# EAGLE design light (EAGLE 9.6.2)
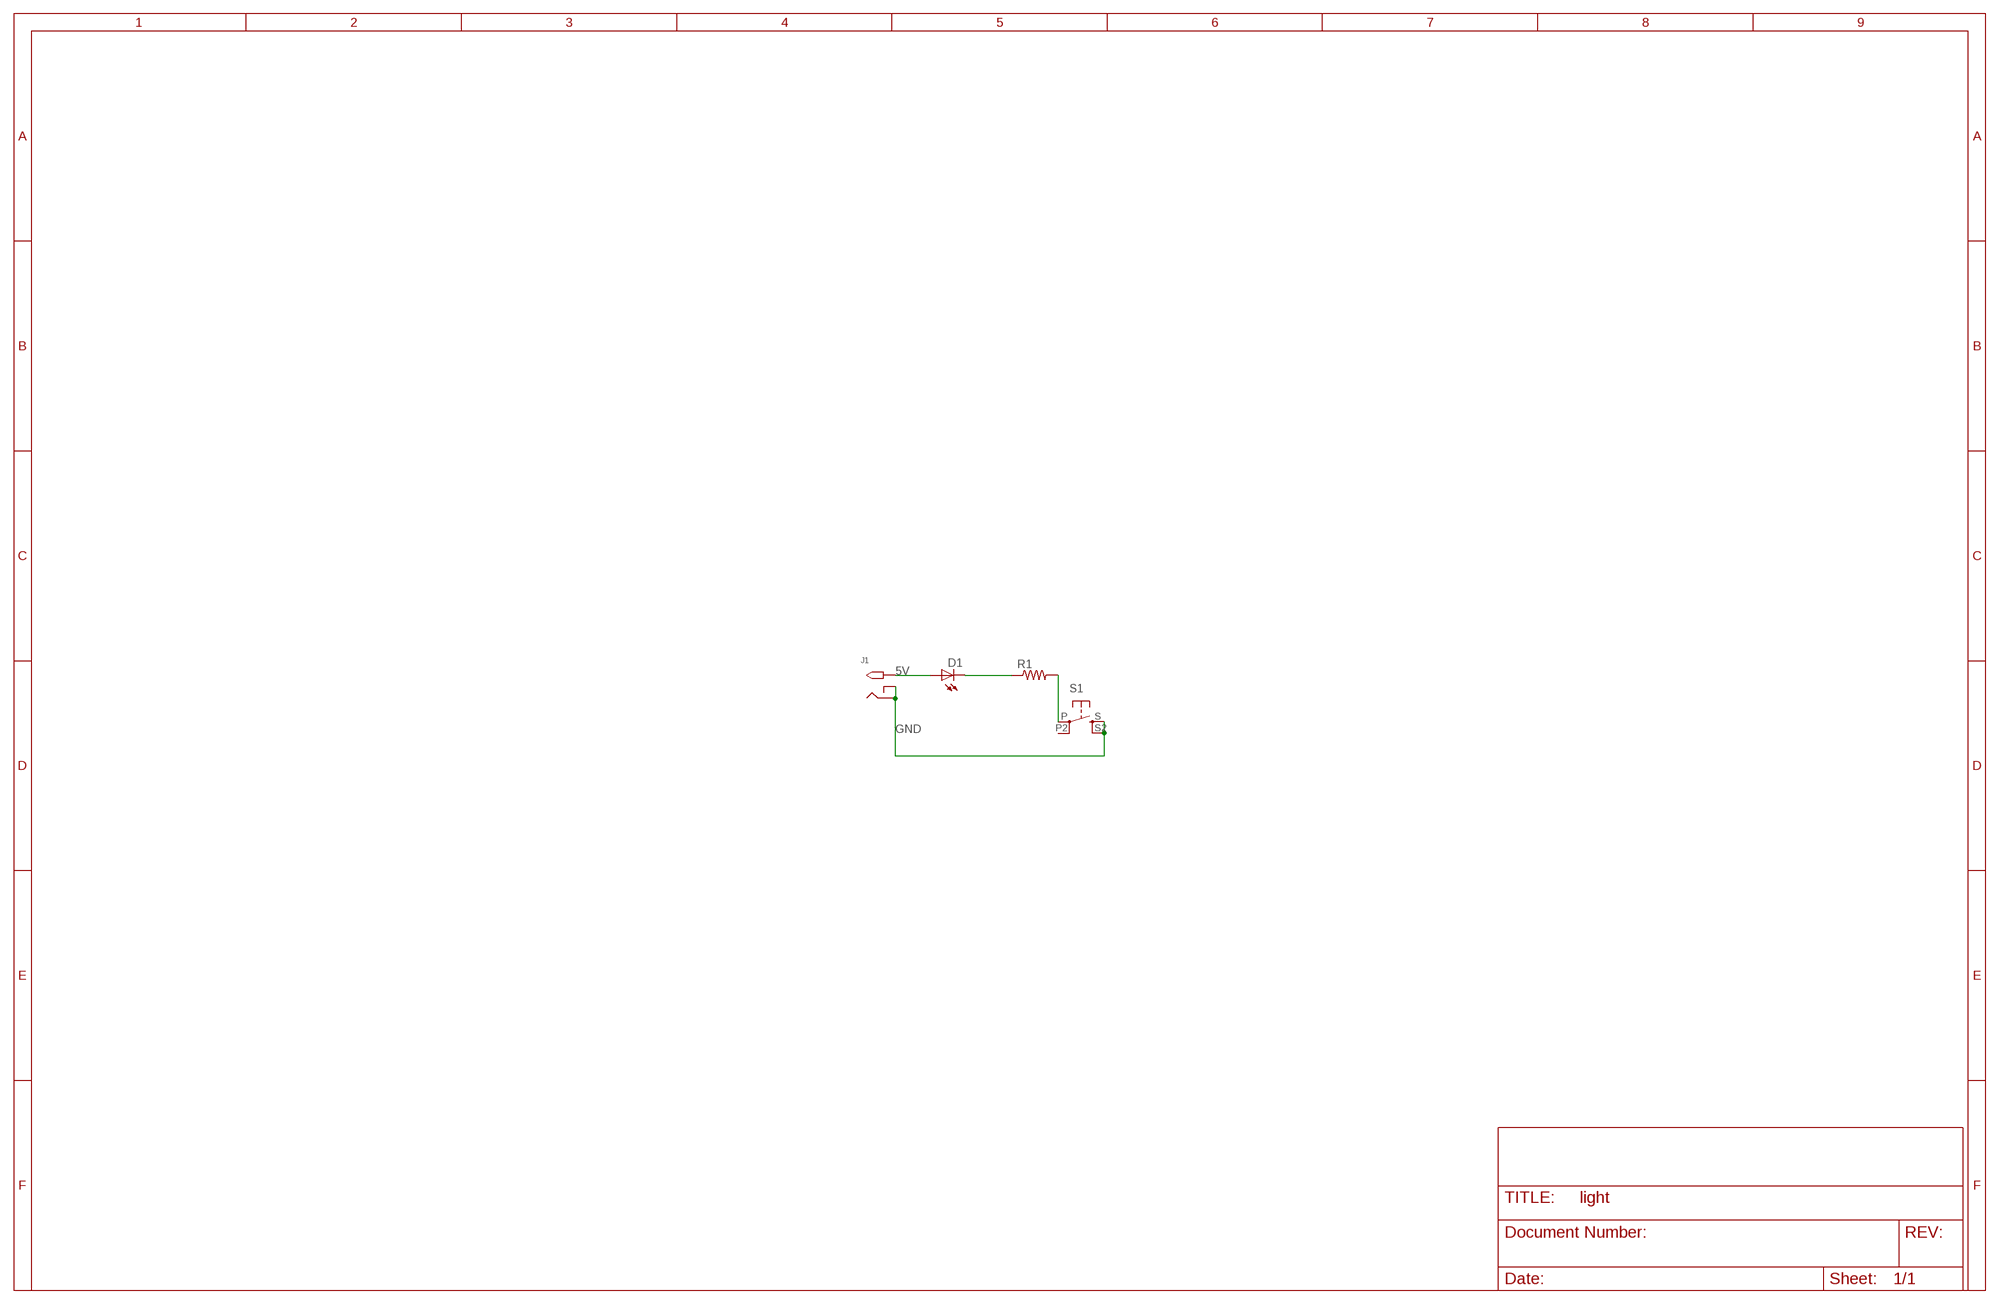
[diagram p0: schematic, sheet 1]
FRAME1 (FRAME_B_L): CREATOR: Unknown; DIST: Unknown; DISTPN: Unknown

## Parts
D1  LED5MM  [LED5MM]
J1  2.1MMJACKTHM  [PJ-102A]
R1  RESISTORTH-1/4W-CARBON  [RESAD1160W55L680D260_HS]
S1  PUSH-BUTTON-SQUARE  [BUTTON-TACTILE-SQUARE-ADAFRUIT1010]

## Nets
5V: D1.A J1.TIP
GND: J1.RING J1.RING_SW S1.S S1.S2(S1)
N$1: D1.K(C) R1.1
N$2: R1.2 S1.P
Unconnected: S1.P2(P1)

## Library data of the parts
D1 = Lab01:LED: /; CREATOR: Swanson; DIST: Adafruit; DISTPN: 297; REVIEWER: Swanson
J1 = Lab01:2.1MMJACK: 2.1mm x 5.5mm THM DC jack with internal switch. Digikey part #PJ-102A, 4UCON part #05537 2.1mm x 5.5mm SMT DC jack with internal switch. Digikey part #PJ-002A-SMT, 4UCON part #03267 By microbuilder.eu & adafruit.com; CREATOR: Swanson; DIST: Digikey; DISTPN: CP-102A-ND; REVIEWER: Swanson
R1 = Lab01:RESISTOR; CREATOR: Swanson; DIST: Digikey; DISTPN: 100QTR-ND; REVIEWER: Swanson
S1 = Lab01:PUSH-BUTTON; CREATOR: Swanson; DIST: Adafruit; DISTPN: 1010; REVIEWER: Swanson

## Board
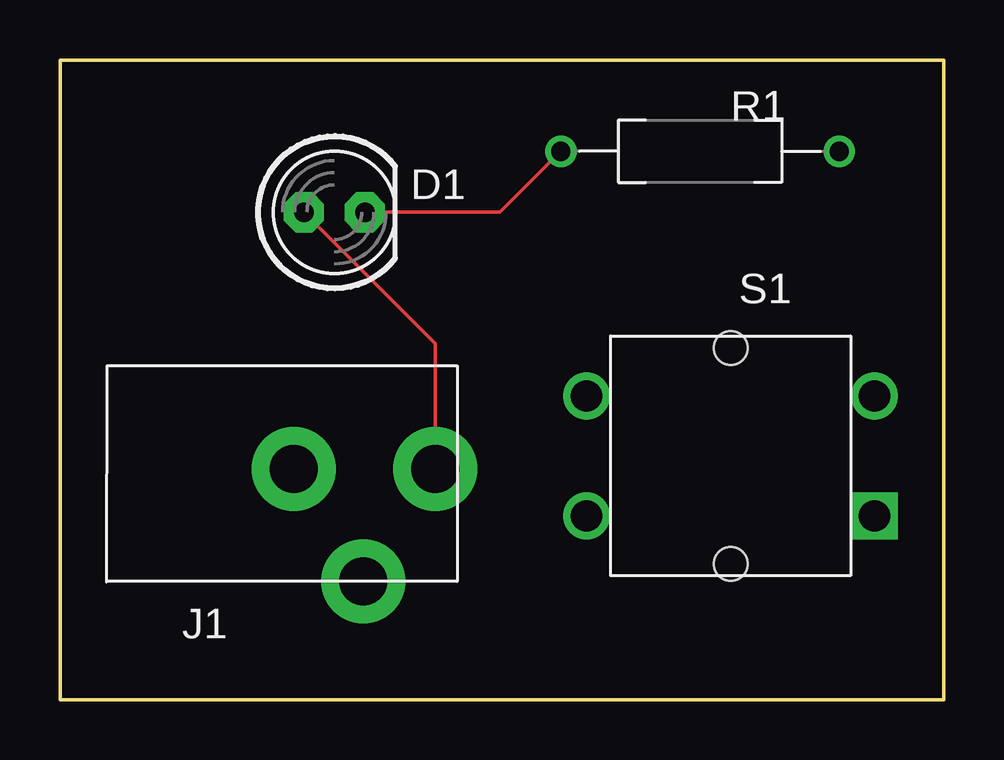
[diagram p1: board, top side]
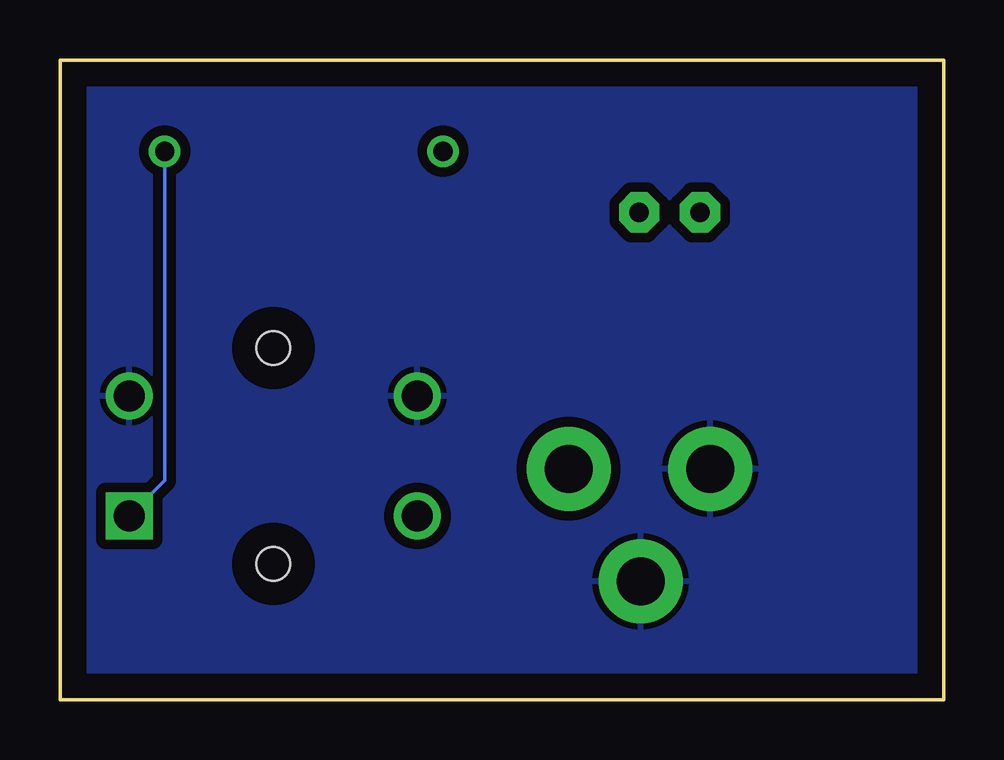
[diagram p2: board, bottom side, seen from below]

Size 36.83 x 26.67 mm. Coordinates in mm from the lower left corner, seen from the top.
Outline: 0,0 0,26.67 36.83,26.67 36.83,0 0,0
Copper layers (1*16): Top 0.035mm / dielectric 1.5mm / Bottom 0.035mm
Design rules "default": minimum track width 6mil, minimum drill 0.35mm, track to track 6mil, track to pad 6mil, pad to pad 6mil, via to via 6mil, smd to smd 6mil, copper to edge 40mil, drill to drill 6mil, minimum pad ring 10mil, minimum via ring 8mil, stop-mask expansion 4mil, vias tented up to drill 0mil, thermal gap 10mil

### Footprints (pad centres in the part's own frame; a part is rotated, then mirrored left to right if it is on the bottom)
LED5MM = drill 0.813 pad 1.676 octagon: A -1.27,0; K 1.27,0
PJ-102A = drill 2 pad 3.5: RING -6.77,-4.345; RING_SW -3.87,-9.045; TIP -0.87,-4.345
RESAD1160W55L680D260_HS = drill 0.8 pad 1.2: 1 -5.8,0; 2 5.8,0
BUTTON-TACTILE-SQUARE-ADAFRUIT1010 = drill 1.3 square: P -6,2.5 | drill 1.3: P2 6,2.5; S -6,-2.5; S2 6,-2.5 | hole 1.4: 0,-4.5; 0,4.5

### Placement (x,y rotation side)
D1  11.43,20.32 0 top
J1  16.51,13.97 0 top
R1  26.67,22.86 0 top
S1  27.94,10.16 180 top

### Tracks (layer width: path | path; a pad name or v marks a point on that pad's centre or on a via)
5V
  Top 0.152: J1.TIP 15.64,14.84 D1.A
GND
  pour Bottom (isolate 0.406): 0,0 0,26.67 36.83,26.67 36.83,0
N$1
  Top 0.152: R1.1 18.33,20.32 D1.K
N$2
  Bottom 0.152: S1.P 32.47,9.13 R1.2